# Altium project PCB_Slave_Traffic_Light.PrjPcb (part 3 of 4)
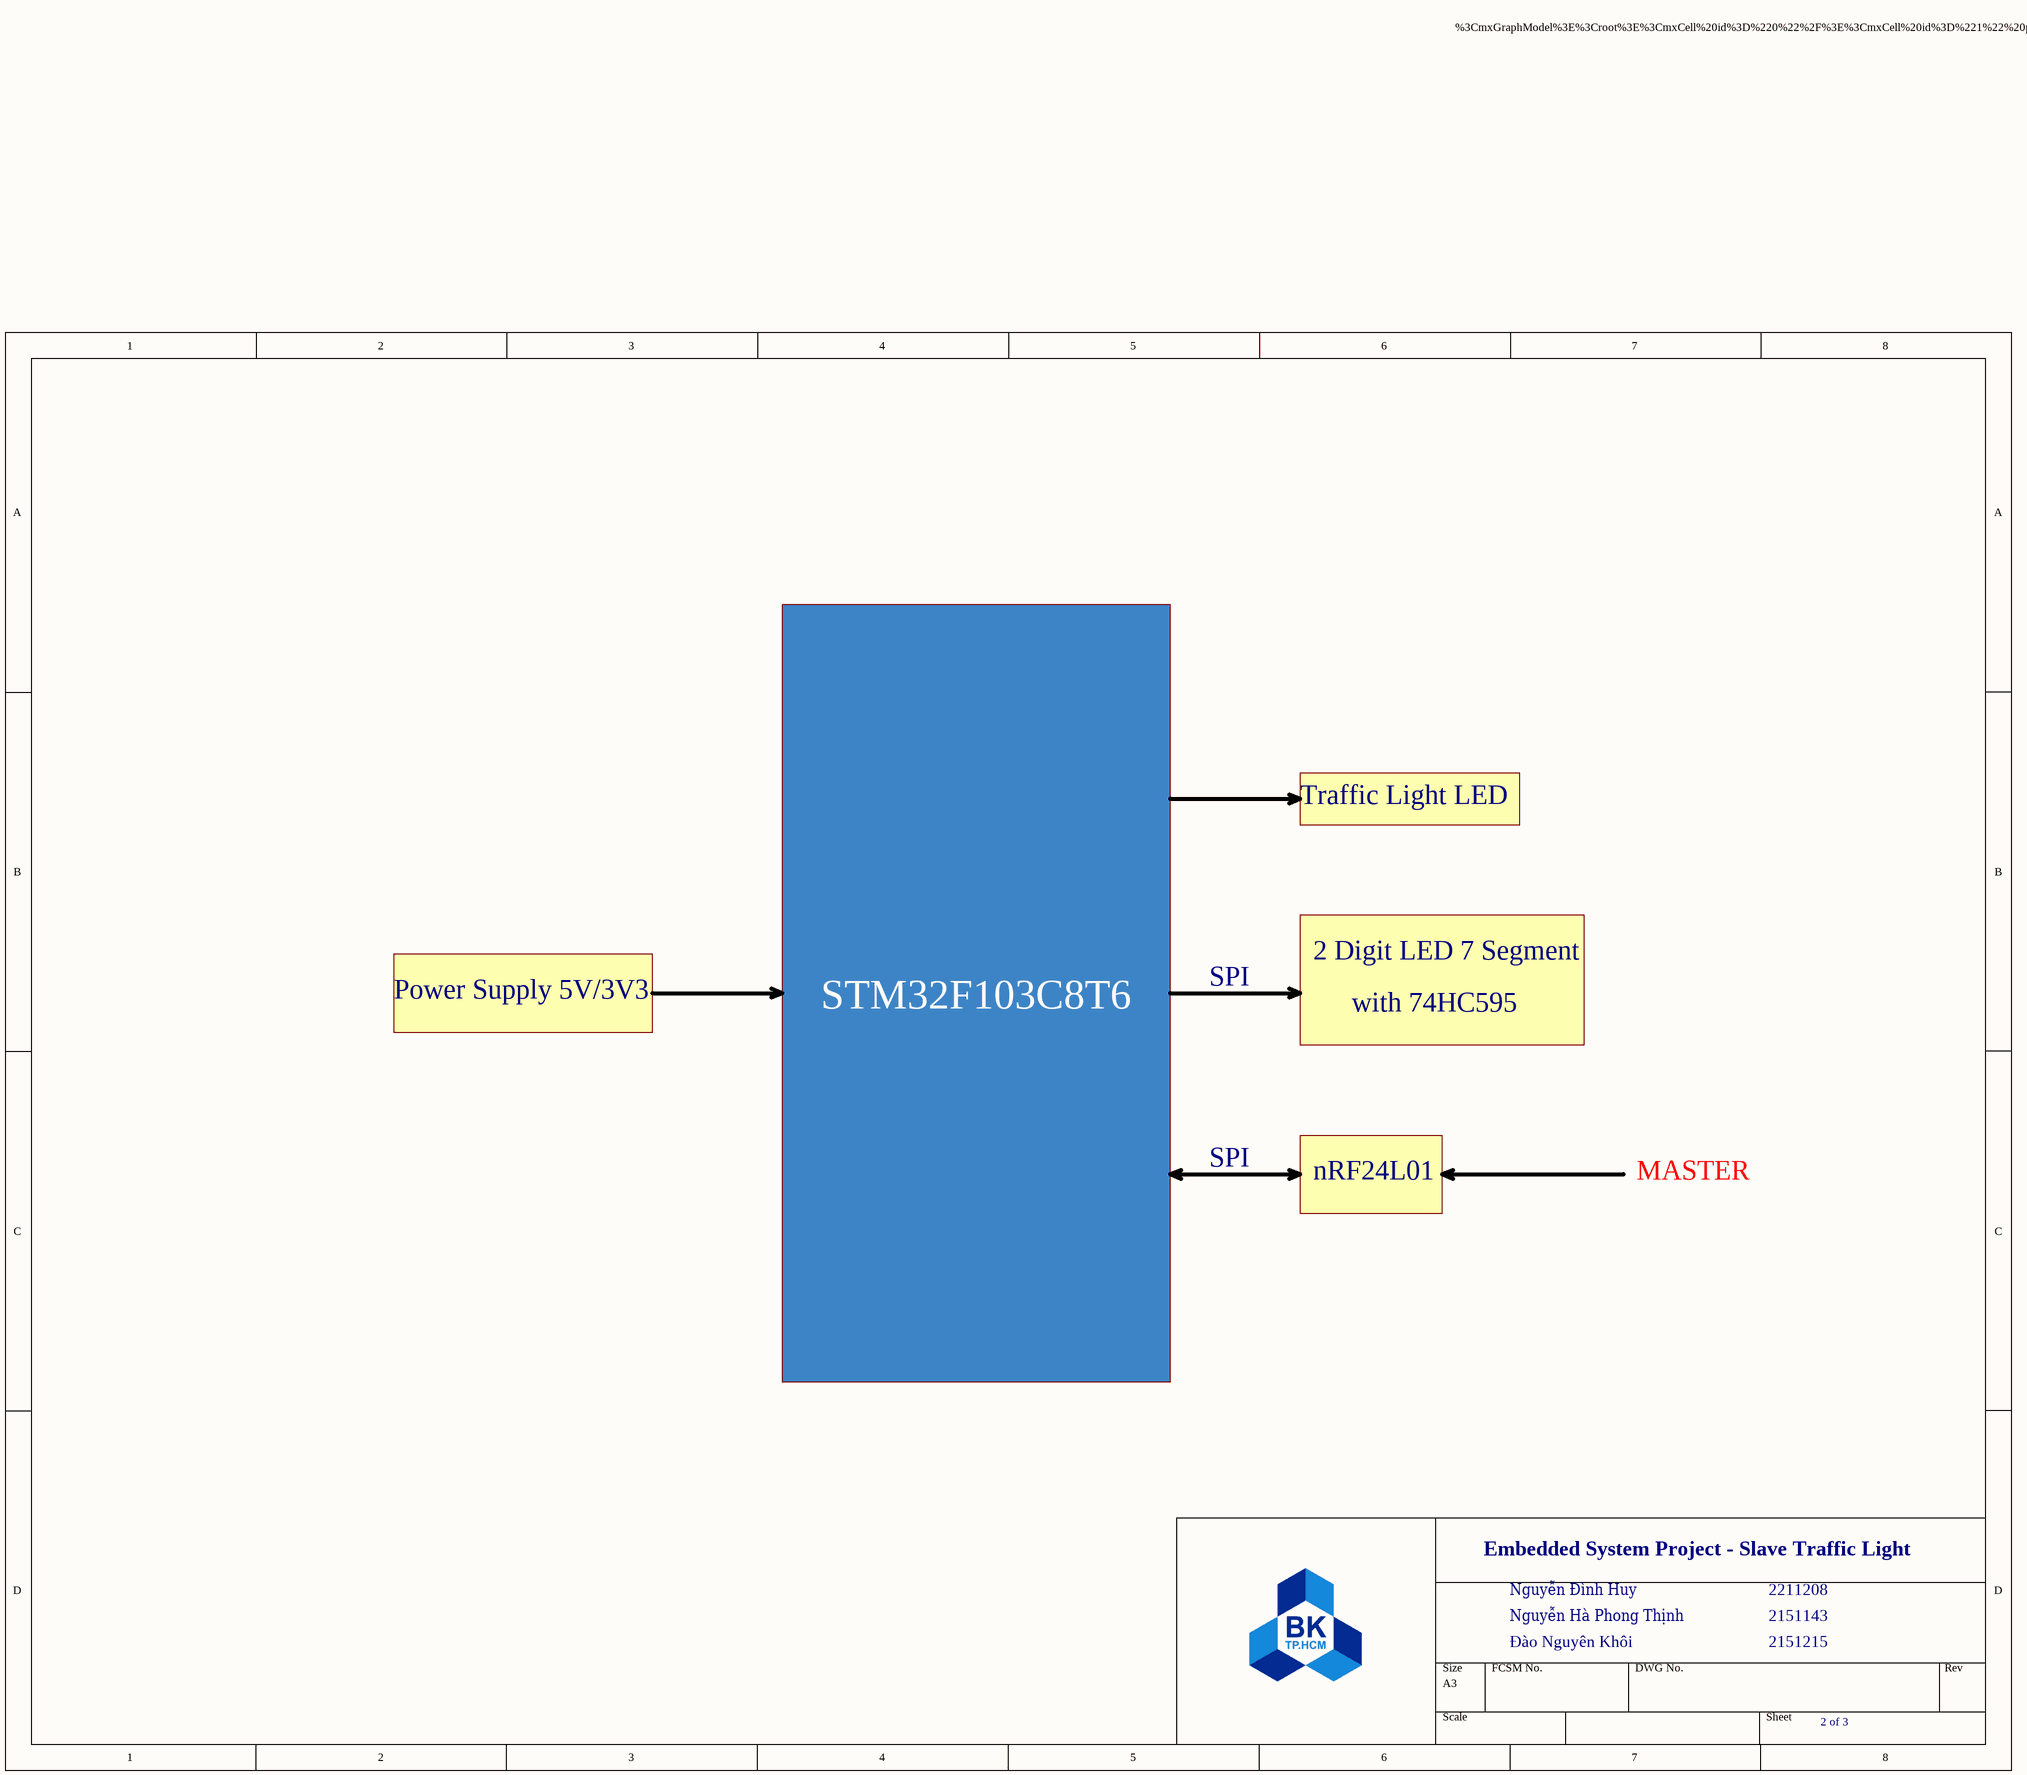
[diagram p4: PCB_Slave_Traffic_Light_BLOCK_DIAGRAM.SchDoc]

## Sheet PCB_Slave_Traffic_Light_BLOCK_DIAGRAM.SchDoc (continued)
0%22%20value%3D%22R1%26lt%3Bdiv%26gt%3B10k%26lt%3B%2Fdiv%26gt%3B%22%20style%3D%22text%3Bhtml%3D1%3Balign%3Dcenter%3BverticalAlign%3Dmiddle%3BwhiteSpace%3Dwrap%3Brounded%3D0%3B%22%20vertex%3D%221%22%20parent%3D%221%22%3E%3CmxGeometry%20x%3D%22528.4%22%20y%3D%221658.46%22%20width%3D%2226%22%20height%3D%2230%22%20as%3D%22geometry%22%2F%3E%3C%2FmxCell%3E%3CmxCell%20id%3D%22111%22%20style%3D%22edgeStyle%3DorthogonalEdgeStyle%3Brounded%3D0%3BorthogonalLoop%3D1%3BjettySize%3Dauto%3Bhtml%3D1%3BexitX%3D0%3BexitY%3D0.5%3BexitDx%3D0%3BexitDy%3D0%3BendArrow%3Dnone%3BstartFill%3D0%3BentryX%3D0.078%3BentryY%3D0.93%3BentryDx%3D0%3BentryDy%3D0%3BentryPerimeter%3D0%3B%22%20edge%3D%221%22%20source%3D%22112%22%20target%3D%22120%22%20parent%3D%221%22%3E%3CmxGeometry%20relative%3D%221%22%20as%3D%22geometry%22%3E%3CmxPoint%20x%3D%22174.4%22%20y%3D%221774.0281690140846%22%20as%3D%22targetPoint%22%2F%3E%3C%2FmxGeometry%3E%3C%2FmxCell%3E%3CmxCell%20id%3D%22112%22%20value%3D%22%26lt%3Bfont%26gt%3BSDA%26lt%3B%2Ffont%26gt%3B%22%20style%3D%22text%3Bhtml%3D1%3Balign%3Dcenter%3BverticalAlign%3Dmiddle%3BwhiteSpace%3Dwrap%3Brounded%3D0%3BfontSize%3D10%3B%22%20vertex%3D%221%22%20parent%3D%221%22%3E%3CmxGeometry%20x%3D%22234.4%22%20y%3D%221769%22%20width%3D%2230%22%20height%3D%2210%22%20as%3D%22geometry%22%2F%3E%3C%2FmxCell%3E%3CmxCell%20id%3D%22113%22%20value%3D%22%26lt%3Bfont%26gt%3BSCL%26lt%3B%2Ffont%26gt%3B%22%20style%3D%22text%3Bhtml%3D1%3Balign%3Dcenter%3BverticalAlign%3Dmiddle%3BwhiteSpace%3Dwrap%3Brounded%3D0%3BfontSize%3D10%3B%22%20vertex%3D%221%22%20parent%3D%221%22%3E%3CmxGeometry%20x%3D%22234.4%22%20y%3D%221784%22%20width%3D%2230%22%20height%3D%2210%22%20as%3D%22geometry%22%2F%3E%3C%2FmxCell%3E%3CmxCell%20id%3D%22114%22%20style%3D%22edgeStyle%3DorthogonalEdgeStyle%3Brounded%3D0%3BorthogonalLoop%3D1%3BjettySize%3Dauto%3Bhtml%3D1%3BexitX%3D0%3BexitY%3D0.5%3BexitDx%3D0%3BexitDy%3D0%3BendArrow%3Dnone%3BstartFill%3D0%3B%22%20edge%3D%221%22%20source%3D%22115%22%20parent%3D%221%22%3E%3CmxGeometry%20relative%3D%221%22%20as%3D%22geometry%22%3E%3CmxPoint%20x%3D%22194.4%22%20y%3D%222014%22%20as%3D%22targetPoint%22%2F%3E%3CArray%20as%3D%22points%22%3E%3CmxPoint%20x%3D%22194.4%22%20y%3D%221979%22%2F%3E%3C%2FArray%3E%3C%2FmxGeometry%3E%3C%2FmxCell%3E%3CmxCell%20id%3D%22115%22%20value%3D%22%26lt%3Bspan%20style%3D%26quot%3Bfont-size%3A%2010px%3B%26quot%3B%26gt%3BGND%26lt%3B%2Fspan%26gt%3B%22%20style%3D%22text%3Bhtml%3D1%3Balign%3Dcenter%3BverticalAlign%3Dmiddle%3BwhiteSpace%3Dwrap%3Brounded%3D0%3B%22%20vertex%3D%221%22%20parent%3D%221%22%3E%3CmxGeometry%20x%3D%22234.4%22%20y%3D%221974%22%20width%3D%2230%22%20height%3D%2210%22%20as%3D%22geometry%22%2F%3E%3C%2FmxCell%3E%3CmxCell%20id%3D%22116%22%20style%3D%22edgeStyle%3DorthogonalEdgeStyle%3Brounded%3D0%3BorthogonalLoop%3D1%3BjettySize%3Dauto%3Bhtml%3D1%3BexitX%3D0%3BexitY%3D0.5%3BexitDx%3D0%3BexitDy%3D0%3BendArrow%3Dnone%3BstartFill%3D0%3B%22%20edge%3D%221%22%20source%3D%22117%22%20parent%3D%221%22%3E%3CmxGeometry%20relative%3D%221%22%20as%3D%22geometry%22%3E%3CmxPoint%20x%3D%22194.4%22%20y%3D%221758.9876543209878%22%20as%3D%22targetPoint%22%2F%3E%3C%2FmxGeometry%3E%3C%2FmxCell%3E%3CmxCell%20id%3D%22117%22%20value%3D%22%26lt%3Bfont%26gt%3BVCC%26lt%3B%2Ffont%26gt%3B%22%20style%3D%22text%3Bhtml%3D1%3Balign%3Dcenter%3BverticalAlign%3Dmiddle%3BwhiteSpace%3Dwrap%3Brounded%3D0%3BfontSize%3D10%3B%22%20vertex%3D%221%22%20parent%3D%221%22%3E%3CmxGeometry%20x%3D%22234.4%22%20y%3D%221754%22%20width%3D%2230%22%20height%3D%2210%22%20as%3D%22geometry%22%2F%3E%3C%2FmxCell%3E%3CmxCell%20id%3D%22118%22%20value%3D%22Out5%22%20style%3D%22text%3Bhtml%3D1%3Balign%3Dcenter%3BverticalAlign%3Dmiddle%3BwhiteSpace%3Dwrap%3Brounded%3D0%3BfontSize%3D10%3B%22%20vertex%3D%221%22%20parent%3D%221%22%3E%3CmxGeometry%20x%3D%22192.2%22%20y%3D%221747%22%20width%3D%2225.6%22%20height%3D%228%22%20as%3D%22geometry%22%2F%3E%3C%2FmxCell%3E%3CmxCell%20id%3D%22119%22%20value%3D%22PB10%22%20style%3D%22text%3Bhtml%3D1%3Balign%3Dcenter%3BverticalAlign%3Dmiddle%3BwhiteSpace%3Dwrap%3Brounded%3D0%3BfontSize%3D10%3B%22%20vertex%3D%221%22%20parent%3D%221%22%3E%3CmxGeometry%20x%3D%22192.2%22%20y%3D%221779%22%20width%3D%2230%22%20height%3D%2210%22%20as%3D%22geometry%22%2F%3E%3C%2FmxCell%3E%3CmxCell%20id%3D%22120%22%20value%3D%22PB11%22%20style%3D%22text%3Bhtml%3D1%3Balign%3Dcenter%3BverticalAlign%3Dmiddle%3BwhiteSpace%3Dwrap%3Brounded%3D0%3BfontSize%3D10%3B%22%20vertex%3D%221%22%20parent%3D%221%22%3E%3CmxGeometry%20x%3D%22192.2%22%20y%3D%221764%22%20width%3D%2230%22%20height%3D%2210%22%20as%3D%22geometry%22%2F%3E%3C%2FmxCell%3E%3CmxCell%20id%3D%22121%22%20style%3D%22edgeStyle%3DorthogonalEdgeStyle%3Brounded%3D0%3BorthogonalLoop%3D1%3BjettySize%3Dauto%3Bhtml%3D1%3BexitX%3D0%3BexitY%3D0.5%3BexitDx%3D0%3BexitDy%3D0%3BentryX%3D0.077%3BentryY%3D0.928%3BentryDx%3D0%3BentryDy%3D0%3BentryPerimeter%3D0%3BendArrow%3Dnone%3BstartFill%3D0%3B%22%20edge%3D%221%22%20source%3D%22113%22%20target%3D%22119%22%20parent%3D%221%22%3E%3CmxGeometry%20relative%3D%221%22%20as%3D%22geometry%22%2F%3E%3C%2FmxCell%3E%3CmxCell%20id%3D%22122%22%20style%3D%22edgeStyle%3DorthogonalEdgeStyle%3Brounded%3D0%3BorthogonalLoop%3D1%3BjettySize%3Dauto%3Bhtml%3D1%3BexitX%3D1%3BexitY%3D0.5%3BexitDx%3D0%3BexitDy%3D0%3BendArrow%3Dnone%3BstartFill%3D0%3B%22%20edge%3D%221%22%20source%3D%22123%22%20parent%3D%221%22%3E%3CmxGeometry%20relative%3D%221%22%20as%3D%22geometry%22%3E%3CmxPoint%20x%3D%22794.4%22%20y%3D%221749%22%20as%3D%22targetPoint%22%2F%3E%3C%2FmxGeometry%3E%3C%2FmxCell%3E%3CmxCell%20id%3D%22123%22%20value%3D%22%26lt%3Bfont%20style%3D%26quot%3Bfont-size%3A%2010px%3B%26quot%3B%26gt%3BPA8%26lt%3B%2Ffont%26gt%3B%22%20style%3D%22text%3Bhtml%3D1%3Balign%3Dcenter%3BverticalAlign%3Dmiddle%3BwhiteSpace%3Dwrap%3Brounded%3D0%3B%22%20vertex%3D%221%22%20parent%3D%221%22%3E%3CmxGeometry%20x%3D%22724.4%22%20y%3D%221744%22%20width%3D%2230%22%20height%3D%2210%22%20as%3D%22geometry%22%2F%3E%3C%2FmxCell%3E%3CmxCell%20id%3D%22124%22%20style%3D%22edgeStyle%3DorthogonalEdgeStyle%3Brounded%3D0%3BorthogonalLoop%3D1%3BjettySize%3Dauto%3Bhtml%3D1%3BexitX%3D1%3BexitY%3D0.5%3BexitDx%3D0%3BexitDy%3D0%3BendArrow%3Dnone%3BstartFill%3D0%3B%22%20edge%3D%221%22%20source%3D%22125%22%20parent%3D%221%22%3E%3CmxGeometry%20relative%3D%221%22%20as%3D%22geometry%22%3E%3CmxPoint%20x%3D%22794.4%22%20y%3D%221739%22%20as%3D%22targetPoint%22%2F%3E%3C%2FmxGeometry%3E%3C%2FmxCell%3E%3CmxCell%20id%3D%22125%22%20value%3D%22%26lt%3Bfont%20style%3D%26quot%3Bfont-size%3A%2010px%3B%26quot%3B%26gt%3BPA9%26lt%3B%2Ffont%26gt%3B%22%20style%3D%22text%3Bhtml%3D1%3Balign%3Dcenter%3BverticalAlign%3Dmiddle%3BwhiteSpace%3Dwrap%3Brounded%3D0%3B%22%20vertex%3D%221%22%20parent%3D%221%22%3E%3CmxGeometry%20x%3D%22724.4%22%20y%3D%221734%22%20width%3D%2230%22%20height%3D%2210%22%20as%3D%22geometry%22%2F%3E%3C%2FmxCell%3E%3CmxCell%20id%3D%22126%22%20style%3D%22edgeStyle%3DorthogonalEdgeStyle%3Brounded%3D0%3BorthogonalLoop%3D1%3BjettySize%3Dauto%3Bhtml%3D1%3BexitX%3D1%3BexitY%3D0.5%3BexitDx%3D0%3BexitDy%3D0%3BendArrow%3Dnone%3BstartFill%3D0%3B%22%20edge%3D%221%22%20source%3D%22127%22%20parent%3D%221%22%3E%3CmxGeometry%20relative%3D%221%22%20as%3D%22geometry%22%3E%3CmxPoint%20x%3D%22794.4%22%20y%3D%221728%22%20as%3D%22targetPoint%22%2F%3E%3C%2FmxGeometry%3E%3C%2FmxCell%3E%3CmxCell%20id%3D%22127%22%20value%3D%22%26lt%3Bfont%20style%3D%26quot%3Bfont-size%3A%2010px%3B%26quot%3B%26gt%3BPA10%26lt%3B%2Ffont%26gt%3B%22%20style%3D%22text%3Bhtml%3D1%3Balign%3Dcenter%3BverticalAlign%3Dmiddle%3BwhiteSpace%3Dwrap%3Brounded%3D0%3B%22%20vertex%3D%221%22%20parent%3D%221%22%3E%3CmxGeometry%20x%3D%22724.4%22%20y%3D%221722.92%22%20width%3D%2230%22%20height%3D%2210%22%20as%3D%22geometry%22%2F%3E%3C%2FmxCell%3E%3CmxCell%20id%3D%22128%22%20value%3D%22%26lt%3Bfont%20style%3D%26quot%3Bfont-size%3A%2010px%3B%26quot%3B%26gt%3BPA10%26lt%3B%2Ffont%26gt%3B%22%20style%3D%22text%3Bhtml%3D1%3Balign%3Dcenter%3BverticalAlign%3Dmiddle%3BwhiteSpace%3Dwrap%3Brounded%3D0%3B%22%20vertex%3D%221%22%20parent%3D%221%22%3E%3CmxGeometry%20x%3D%22774.4%22%20y%3D%221722.92%22%20width%3D%2220%22%20height%3D%220.54%22%20as%3D%22geometry%22%2F%3E%3C%2FmxCell%3E%3CmxCell%20id%3D%22129%22%20value%3D%22%26lt%3Bfont%20style%3D%26quot%3Bfont-size%3A%2010px%3B%26quot%3B%26gt%3BPA9%26lt%3B%2Ffont%26gt%3B%22%20style%3D%22text%3Bhtml%3D1%3Balign%3Dcenter%3BverticalAlign%3Dmiddle%3BwhiteSpace%3Dwrap%3Brounded%3D0%3B%22%20vertex%3D%221%22%20parent%3D%221%22%3E%3CmxGeometry%20x%3D%22774.4%22%20y%3D%221732.92%22%20width%3D%2220%22%20height%3D%221.08%22%20as%3D%22geometry%22%2F%3E%3C%2FmxCell%3E%3CmxCell%20id%3D%22130%22%20value%3D%22%26lt%3Bfont%20style%3D%26quot%3Bfont-size%3A%2010px%3B%26quot%3B%26gt%3BPA8%26lt%3B%2Ffont%26gt%3B%22%20style%3D%22text%3Bhtml%3D1%3Balign%3Dcenter%3BverticalAlign%3Dmiddle%3BwhiteSpace%3Dwrap%3Brounded%3D0%3B%22%20vertex%3D%221%22%20parent%3D%221%22%3E%3CmxGeometry%20x%3D%22774.4%22%20y%3D%221742.92%22%20width%3D%2220%22%20height%3D%221.08%22%20as%3D%22geometry%22%2F%3E%3C%2FmxCell%3E%3CmxCell%20id%3D%22131%22%20style%3D%22edgeStyle%3DorthogonalEdgeStyle%3Brounded%3D0%3BorthogonalLoop%3D1%3BjettySize%3Dauto%3Bhtml%3D1%3BexitX%3D0%3BexitY%3D0.5%3BexitDx%3D0%3BexitDy%3D0%3BendArrow%3Dnone%3BstartFill%3D0%3B%22%20edge%3D%221%22%20source%3D%22132%22%20parent%3D%221%22%3E%3CmxGeometry%20relative%3D%221%22%20as%3D%22geometry%22%3E%3CmxPoint%20x%3D%22594.4%22%20y%3D%221749.0467289719627%22%20as%3D%22targetPoint%22%2F%3E%3C%2FmxGeometry%3E%3C%2FmxCell%3E%3CmxCell%20id%3D%22132%22%20value%3D%22%26lt%3Bfont%20style%3D%26quot%3Bfont-size%3A%2010px%3B%26quot%3B%26gt%3BPB11%26lt%3B%2Ffont%26gt%3B%22%20style%3D%22text%3Bhtml%3D1%3Balign%3Dcenter%3BverticalAlign%3Dmiddle%3BwhiteSpace%3Dwrap%3Brounded%3D0%3B%22%20vertex%3D%221%22%20parent%3D%221%22%3E%3CmxGeometry%20x%3D%22634.4%22%20y%3D%221744%22%20width%3D%2230%22%20height%3D%2210%22%20as%3D%22geometry%22%2F%3E%3C%2FmxCell%3E%3CmxCell%20id%3D%22133%22%20style%3D%22edgeStyle%3DorthogonalEdgeStyle%3Brounded%3D0%3BorthogonalLoop%3D1%3BjettySize%3Dauto%3Bhtml%3D1%3BexitX%3D0%3BexitY%3D0.5%3BexitDx%3D0%3BexitDy%3D0%3BendArrow%3Dnone%3BstartFill%3D0%3B%22%20edge%3D%221%22%20source%3D%22134%22%20parent%3D%221%22%3E%3CmxGeometry%20relative%3D%221%22%20as%3D%22geometry%22%3E%3CmxPoint%20x%3D%22594.4%22%20y%3D%221739.0467289719627%22%20as%3D%22targetPoint%22%2F%3E%3C%2FmxGeometry%3E%3C%2FmxCell%3E%3CmxCell%20id%3D%22134%22%20value%3D%22%26lt%3Bfont%20style%3D%26quot%3Bfont-size%3A%2010px%3B%26quot%3B%26gt%3BPB10%26lt%3B%2Ffont%26gt%3B%22%20style%3D%22text%3Bhtml%3D1%3Balign%3Dcenter%3BverticalAlign%3Dmiddle%3BwhiteSpace%3Dwrap%3Brounded%3D0%3B%22%20vertex%3D%221%22%20parent%3D%221%22%3E%3CmxGeometry%20x%3D%22634.4%22%20y%3D%221734%22%20width%3D%2230%22%20height%3D%2210%22%20as%3D%22geometry%22%2F%3E%3C%2FmxCell%3E%3CmxCell%20id%3D%22135%22%20value%3D%22%26lt%3Bfont%26gt%3BPB11%26lt%3B%2Ffont%26gt%3B%22%20style%3D%22text%3Bhtml%3D1%3Balign%3Dcenter%3BverticalAlign%3Dmiddle%3BwhiteSpace%3Dwrap%3Brounded%3D0%3BfontSize%3D10%3B%22%20vertex%3D%221%22%20parent%3D%221%22%3E%3CmxGeometry%20x%3D%22598.4%22%20y%3D%221739.54%22%20width%3D%2220%22%20height%3D%2210%22%20as%3D%22geometry%22%2F%3E%3C%2FmxCell%3E%3CmxCell%20id%3D%22136%22%20value%3D%22%26lt%3Bfont%26gt%3BPB10%26lt%3B%2Ffont%26gt%3B%22%20style%3D%22text%3Bhtml%3D1%3Balign%3Dcenter%3BverticalAlign%3Dmiddle%3BwhiteSpace%3Dwrap%3Brounded%3D0%3BfontSize%3D10%3B%22%20vertex%3D%221%22%20parent%3D%221%22%3E%3CmxGeometry%20x%3D%22598.4%22%20y%3D%221729.54%22%20width%3D%2220%22%20height%3D%2210%22%20as%3D%22geometry%22%2F%3E%3C%2FmxCell%3E%3CmxCell%20id%3D%22137%22%20style%3D%22edgeStyle%3DorthogonalEdgeStyle%3Brounded%3D0%3BorthogonalLoop%3D1%3BjettySize%3Dauto%3Bhtml%3D1%3BexitX%3D1%3BexitY%3D0.5%3BexitDx%3D0%3BexitDy%3D0%3BendArrow%3Dnone%3BstartFill%3D0%3B%22%20edge%3D%221%22%20source%3D%22138%22%20parent%3D%221%22%3E%3CmxGeometry%20relative%3D%221%22%20as%3D%22geometry%22%3E%3CmxPoint%20x%3D%22430%22%20y%3D%221287.4545454545455%22%20as%3D%22targetPoint%22%2F%3E%3C%2FmxGeometry%3E%3C%2FmxCell%3E%3CmxCell%20id%3D%22138%22%20value%3D%22VDD%22%20style%3D%22text%3Bhtml%3D1%3Balign%3Dcenter%3BverticalAlign%3Dmiddle%3BwhiteSpace%3Dwrap%3Brounded%3D0%3BfontSize%3D10%3B%22%20vertex%3D%221%22%20parent%3D%221%22%3E%3CmxGeometry%20x%3D%22364%22%20y%3D%221280%22%20width%3D%2226%22%20height%3D%2215%22%20as%3D%22geometry%22%2F%3E%3C%2FmxCell%3E%3CmxCell%20id%3D%22139%22%20style%3D%22edgeStyle%3DorthogonalEdgeStyle%3Brounded%3D0%3BorthogonalLoop%3D1%3BjettySize%3Dauto%3Bhtml%3D1%3BexitX%3D1%3BexitY%3D0.5%3BexitDx%3D0%3BexitDy%3D0%3BendArrow%3Dnone%3BstartFill%3D0%3B%22%20edge%3D%221%22%20source%3D%22140%22%20parent%3D%221%22%3E%3CmxGeometry%20relative%3D%221%22%20as%3D%22geometry%22%3E%3CmxPoint%20x%3D%22430%22%20y%3D%221317.4545454545455%22%20as%3D%22targetPoint%22%2F%3E%3C%2FmxGeometry%3E%3C%2FmxCell%3E%3CmxCell%20id%3D%22140%22%20value%3D%22CE%22%20style%3D%22text%3Bhtml%3D1%3Balign%3Dcenter%3BverticalAlign%3Dmiddle%3BwhiteSpace%3Dwrap%3Brounded%3D0%3BfontSize%3D10%3B%22%20vertex%3D%221%22%20parent%3D%221%22%3E%3CmxGeometry%20x%3D%22364%22%20y%3D%221310%22%20width%3D%2226%22%20height%3D%2215%22%20as%3D%22geometry%22%2F%3E%3C%2FmxCell%3E%3CmxCell%20id%3D%22141%22%20style%3D%22edgeStyle%3DorthogonalEdgeStyle%3Brounded%3D0%3BorthogonalLoop%3D1%3BjettySize%3Dauto%3Bhtml%3D1%3BexitX%3D1%3BexitY%3D0.5%3BexitDx%3D0%3BexitDy%3D0%3BendArrow%3Dnone%3BstartFill%3D0%3B%22%20edge%3D%221%22%20source%3D%22142%22%20parent%3D%221%22%3E%3CmxGeometry%20relative%3D%221%22%20as%3D%22geometry%22%3E%3CmxPoint%20x%3D%22430%22%20y%3D%221331.4805194805194%22%20as%3D%22targetPoint%22%2F%3E%3C%2FmxGeometry%3E%3C%2FmxCell%3E%3CmxCell%20id%3D%22142%22%20value%3D%22SCK%22%20style%3D%22text%3Bhtml%3D1%3Balign%3Dcenter%3BverticalAlign%3Dmiddle%3BwhiteSpace%3Dwrap%3Brounded%3D0%3BfontSize%3D10%3B%22%20vertex%3D%221%22%20parent%3D%221%22%3E%3CmxGeometry%20x%3D%22364%22%20y%3D%221323.92%22%20width%3D%2226%22%20height%3D%2215%22%20as%3D%22geometry%22%2F%3E%3C%2FmxCell%3E%3CmxCell%20id%3D%22143%22%20style%3D%22edgeStyle%3DorthogonalEdgeStyle%3Brounded%3D0%3BorthogonalLoop%3D1%3BjettySize%3Dauto%3Bhtml%3D1%3BexitX%3D1%3BexitY%3D0.5%3BexitDx%3D0%3BexitDy%3D0%3BendArrow%3Dnone%3BstartFill%3D0%3B%22%20edge%3D%221%22%20source%3D%22144%22%20parent%3D%221%22%3E%3CmxGeometry%20relative%3D%221%22%20as%3D%22geometry%22%3E%3CmxPoint%20x%3D%22430%22%20y%3D%221345%22%20as%3D%22targetPoint%22%2F%3E%3CArray%20as%3D%22points%22%3E%3CmxPoint%20x%3D%22430%22%20y%3D%221345%22%2F%3E%3C%2FArray%3E%3C%2FmxGeometry%3E%3C%2FmxCell%3E%3CmxCell%20id%3D%22144%22%20value%3D%22MISO%22%20style%3D%22text%3Bhtml%3D1%3Balign%3Dcenter%3BverticalAlign%3Dmiddle%3BwhiteSpace%3Dwrap%3Brounded%3D0%3BfontSize%3D10%3B%22%20vertex%3D%221%22%20parent%3D%221%22%3E%3CmxGeometry%20x%3D%22364%22%20y%3D%221337.5%22%20width%3D%2226%22%20height%3D%2215%22%20as%3D%22geometry%22%2F%3E%3C%2FmxCell%3E%3CmxCell%20id%3D%22145%22%20style%3D%22edgeStyle%3DorthogonalEdgeStyle%3Brounded%3D0%3BorthogonalLoop%3D1%3BjettySize%3Dauto%3Bhtml%3D1%3BexitX%3D1%3BexitY%3D0.5%3BexitDx%3D0%3BexitDy%3D0%3BendArrow%3Dnone%3BstartFill%3D0%3B%22%20edge%3D%221%22%20source%3D%22146%22%20parent%3D%221%22%3E%3CmxGeometry%20relative%3D%221%22%20as%3D%22geometry%22%3E%3CmxPoint%20x%3D%22430%22%20y%3D%221360%22%20as%3D%22targetPoint%22%2F%3E%3CArray%20as%3D%22points%22%3E%3CmxPoint%20x%3D%22420%22%20y%3D%221360%22%2F%3E%3CmxPoint%20x%3D%22420%22%20y%3D%221360%22%2F%3E%3C%2FArray%3E%3C%2FmxGeometry%3E%3C%2FmxCell%3E%3CmxCell%20id%3D%22146%22%20value%3D%22MOSI%22%20style%3D%22text%3Bhtml%3D1%3Balign%3Dcenter%3BverticalAlign%3Dmiddle%3BwhiteSpace%3Dwrap%3Brounded%3D0%3BfontSize%3D10%3B%22%20vertex%3D%221%22%20parent%3D%221%22%3E%3CmxGeometry%20x%3D%22364%22%20y%3D%221352.5%22%20width%3D%2226%22%20height%3D%2215%22%20as%3D%22geometry%22%2F%3E%3C%2FmxCell%3E%3CmxCell%20id%3D%22147%22%20style%3D%22edgeStyle%3DorthogonalEdgeStyle%3Brounded%3D0%3BorthogonalLoop%3D1%3BjettySize%3Dauto%3Bhtml%3D1%3BexitX%3D1%3BexitY%3D0.5%3BexitDx%3D0%3BexitDy%3D0%3BendArrow%3Dnone%3BstartFill%3D0%3B%22%20edge%3D%221%22%20source%3D%22148%22%20parent%3D%221%22%3E%3CmxGeometry%20relative%3D%221%22%20as%3D%22geometry%22%3E%3CmxPoint%20x%3D%22429%22%20y%3D%221420%22%20as%3D%22targetPoint%22%2F%3E%3CmxPoint%20x%3D%22389%22%20y%3D%221388.92%22%20as%3D%22sourcePoint%22%2F%3E%3CArray%20as%3D%22points%22%3E%3CmxPoint%20x%3D%22430%22%20y%3D%221389%22%2F%3E%3CmxPoint%20x%3D%22430%22%20y%3D%221420%22%2F%3E%3C%2FArray%3E%3C%2FmxGeometry%3E%3C%2FmxCell%3E%3CmxCell%20id%3D%22148%22%20value%3D%22GND%22%20style%3D%22text%3Bhtml%3D1%3Balign%3Dcenter%3BverticalAlign%3Dmiddle%3BwhiteSpace%3Dwrap%3Brounded%3D0%3BfontSize%3D10%3B%22%20vertex%3D%221%22%20parent%3D%221%22%3E%3CmxGeometry%20x%3D%22364%22%20y%3D%221383.92%22%20width%3D%2226%22%20height%3D%2210%22%20as%3D%22geometry%22%2F%3E%3C%2FmxCell%3E%3CmxCell%20id%3D%22149%22%20style%3D%22edgeStyle%3DorthogonalEdgeStyle%3Brounded%3D0%3BorthogonalLoop%3D1%3BjettySize%3Dauto%3Bhtml%3D1%3BexitX%3D0%3BexitY%3D0.5%3BexitDx%3D0%3BexitDy%3D0%3BendArrow%3Dnone%3BstartFill%3D0%3B%22%20edge%3D%221%22%20source%3D%22150%22%20parent%3D%221%22%3E%3CmxGeometry%20relative%3D%221%22%20as%3D%22geometry%22%3E%3CmxPoint%20x%3D%22190%22%20y%3D%221327.4545454545455%22%20as%3D%22targetPoint%22%2F%3E%3C%2FmxGeometry%3E%3C%2FmxCell%3E%3CmxCell%20id%3D%22150%22%20value%3D%22IRQ%22%20style%3D%22text%3Bhtml%3D1%3Balign%3Dcenter%3BverticalAlign%3Dmiddle%3BwhiteSpace%3Dwrap%3Brounded%3D0%3BfontSize%3D10%3B%22%20vertex%3D%221%22%20parent%3D%221%22%3E%3CmxGeometry%20x%3D%22229.6%22%20y%3D%221320%22%20width%3D%2226%22%20height%3D%2215%22%20as%3D%22geometry%22%2F%3E%3C%2FmxCell%3E%3CmxCell%20id%3D%22151%22%20style%3D%22edgeStyle%3DorthogonalEdgeStyle%3Brounded%3D0%3BorthogonalLoop%3D1%3BjettySize%3Dauto%3Bhtml%3D1%3BexitX%3D0%3BexitY%3D0.5%3BexitDx%3D0%3BexitDy%3D0%3BendArrow%3Dnone%3BstartFill%3D0%3B%22%20edge%3D%221%22%20source%3D%22152%22%20parent%3D%221%22%3E%3CmxGeometry%20relative%3D%221%22%20as%3D%22geometry%22%3E%3CmxPoint%20x%3D%22190%22%20y%3D%221357.4545454545455%22%20as%3D%22targetPoint%22%2F%3E%3C%2FmxGeometry%3E%3C%2FmxCell%3E%3CmxCell%20id%3D%22152%22%20value%3D%22CSN%22%20style%3D%22text%3Bhtml%3D1%3Balign%3Dcenter%3BverticalAlign%3Dmiddle%3BwhiteSpace%3Dwrap%3Brounded%3D0%3BfontSize%3D10%3B%22%20vertex%3D%221%22%20parent%3D%221%22%3E%3CmxGeometry%20x%3D%22230%22%20y%3D%221350%22%20width%3D%2226%22%20height%3D%2215%22%20as%3D%22geometry%22%2F%3E%3C%2FmxCell%3E%3CmxCell%20id%3D%22153%22%20value%3D%22%22%20style%3D%22endArrow%3Dnone%3Bhtml%3D1%3Brounded%3D0%3BexitX%3D0.875%3BexitY%3D0.002%3BexitDx%3D0%3BexitDy%3D0%3BexitPerimeter%3D0%3BentryX%3D0.175%3BentryY%3D0.016%3BentryDx%3D0%3BentryDy%3D0%3BentryPerimeter%3D0%3B%22%20edge%3D%221%22%20source%3D%22150%22%20target%3D%22150%22%20parent%3D%221%22%3E%3CmxGeometry%20width%3D%2250%22%20height%3D%2250%22%20relative%3D%221%22%20as%3D%22geometry%22%3E%3CmxPoint%20x%3D%22245.4%22%20y%3D%221321.51%22%20as%3D%22sourcePoint%22%2F%3E%3CmxPoint%20x%3D%22239.79999999999998%22%20y%3D%221320.0046236559142%22%20as%3D%22targetPoint%22%2F%3E%3C%2FmxGeometry%3E%3C%2FmxCell%3E%3CmxCell%20id%3D%22154%22%20value%3D%22%22%20style%3D%22endArrow%3Dnone%3Bhtml%3D1%3Brounded%3D0%3BexitX%3D0.875%3BexitY%3D0.002%3BexitDx%3D0%3BexitDy%3D0%3BexitPerimeter%3D0%3BentryX%3D0.175%3BentryY%3D0.016%3BentryDx%3D0%3BentryDy%3D0%3BentryPerimeter%3D0%3B%22%20edge%3D%221%22%20parent%3D%221%22%3E%3CmxGeometry%20width%3D%2250%22%20height%3D%2250%22%20relative%3D%221%22%20as%3D%22geometry%22%3E%3CmxPoint%20x%3D%22251.6%22%20y%3D%221350%22%20as%3D%22sourcePoint%22%2F%3E%3CmxPoint%20x%3D%22233.6%22%20y%3D%221350%22%20as%3D%22targetPoint%22%2F%3E%3C%2FmxGeometry%3E%3C%2FmxCell%3E%3CmxCell%20id%3D%22155%22%20value%3D%22PA1%22%20style%3D%22text%3Bhtml%3D1%3Balign%3Dcenter%3BverticalAlign%3Dmiddle%3BwhiteSpace%3Dwrap%3Brounded%3D0%3BfontSize%3D10%3B%22%20vertex%3D%221%22%20parent%3D%221%22%3E%3CmxGeometry%20x%3D%22410%22%20y%3D%221280%22%20width%3D%2220%22%20as%3D%22geometry%22%2F%3E%3C%2FmxCell%3E%3CmxCell%20id%3D%22156%22%20value%3D%22PA3%22%20style%3D%22text%3Bhtml%3D1%3Balign%3Dcenter%3BverticalAlign%3Dmiddle%3BwhiteSpace%3Dwrap%3Brounded%3D0%3BfontSize%3D10%3B%22%20vertex%3D%221%22%20parent%3D%221%22%3E%3CmxGeometry%20x%3D%22410%22%20y%3D%221310%22%20width%3D%2220%22%20as%3D%22geometry%22%2F%3E%3C%2FmxCell%3E%3CmxCell%20id%3D%22157%22%20value%3D%22PA5%22%20style%3D%22text%3Bhtml%3D1%3Balign%3Dcenter%3BverticalAlign%3Dmiddle%3BwhiteSpace%3Dwrap%3Brounded%3D0%3BfontSize%3D10%3B%22%20vertex%3D%221%22%20parent%3D%221%22%3E%3CmxGeometry%20x%3D%22410%22%20y%3D%221325%22%20width%3D%2220%22%20as%3D%22geometry%22%2F%3E%3C%2FmxCell%3E%3CmxCell%20id%3D%22158%22%20value%3D%22PA6%22%20style%3D%22text%3Bhtml%3D1%3Balign%3Dcenter%3BverticalAlign%3Dmiddle%3BwhiteSpace%3Dwrap%3Brounded%3D0%3BfontSize%3D10%3B%22%20vertex%3D%221%22%20parent%3D%221%22%3E%3CmxGeometry%20x%3D%22410%22%20y%3D%221338.92%22%20width%3D%2220%22%20as%3D%22geometry%22%2F%3E%3C%2FmxCell%3E%3CmxCell%20id%3D%22159%22%20value%3D%22PA7%22%20style%3D%22text%3Bhtml%3D1%3Balign%3Dcenter%3BverticalAlign%3Dmiddle%3BwhiteSpace%3Dwrap%3Brounded%3D0%3BfontSize%3D10%3B%22%20vertex%3D%221%22%20parent%3D%221%22%3E%3CmxGeometry%20x%3D%22410%22%20y%3D%221353.92%22%20width%3D%2220%22%20as%3D%22geometry%22%2F%3E%3C%2FmxCell%3E%3CmxCell%20id%3D%22160%22%20value%3D%22PA0%22%20style%3D%22text%3Bhtml%3D1%3Balign%3Dcenter%3BverticalAlign%3Dmiddle%3BwhiteSpace%3Dwrap%3Brounded%3D0%3BfontSize%3D10%3B%22%20vertex%3D%221%22%20parent%3D%221%22%3E%3CmxGeometry%20x%3D%22190%22%20y%3D%221320%22%20width%3D%2220%22%20as%3D%22geometry%22%2F%3E%3C%2FmxCell%3E%3CmxCell%20id%3D%22161%22%20value%3D%22PA4%22%20style%3D%22text%3Bhtml%3D1%3Balign%3Dcenter%3BverticalAlign%3Dmiddle%3BwhiteSpace%3Dwrap%3Brounded%3D0%3BfontSize%3D10%3B%22%20vertex%3D%221%22%20parent%3D%221%22%3E%3CmxGeometry%20x%3D%22190%22%20y%3D%221350%22%20width%3D%2220%22%20as%3D%22geometry%22%2F%3E%3C%2FmxCell%3E%3CmxCell%20id%3D%22162%22%20value%3D%22%26lt%3Bfont%20style%3D%26quot%3Bfont-size%3A%2010px%3B%26quot%3B%26gt%3BPA7%26lt%3B%2Ffont%26gt%3B%22%20style%3D%22text%3Bhtml%3D1%3Balign%3Dcenter%3BverticalAlign%3Dmiddle%3BwhiteSpace%3Dwrap%3Brounded%3D0%3B%22%20vertex%3D%221%22%20parent%3D%221%22%3E%3CmxGeometry%20x%3D%22634.4%22%20y%3D%221704%22%20width%3D%2230%22%20height%3D%2210%22%20as%3D%22geometry%22%2F%3E%3C%2FmxCell%3E%3CmxCell%20id%3D%22163%22%20value%3D%22%26lt%3Bfont%20style%3D%26quot%3Bfont-size%3A%2010px%3B%26quot%3B%26gt%3BPA6%26lt%3B%2Ffont%26gt%3B%22%20style%3D%22text%3Bhtml%3D1%3Balign%3Dcenter%3BverticalAlign%3Dmiddle%3BwhiteSpace%3Dwrap%3Brounded%3D0%3B%22%20vertex%3D%221%22%20parent%3D%221%22%3E%3CmxGeometry%20x%3D%22634.4%22%20y%3D%221694%22%20width%3D%2230%22%20height%3D%2210%22%20as%3D%22geometry%22%2F%3E%3C%2FmxCell%3E%3CmxCell%20id%3D%22164%22%20value%3D%22%26lt%3Bfont%20style%3D%26quot%3Bfont-size%3A%2010px%3B%26quot%3B%26gt%3BPA5%26lt%3B%2Ffont%26gt%3B%22%20style%3D%22text%3Bhtml%3D1%3Balign%3Dcenter%3BverticalAlign%3Dmiddle%3BwhiteSpace%3Dwrap%3Brounded%3D0%3B%22%20vertex%3D%221%22%20parent%3D%221%22%3E%3CmxGeometry%20x%3D%22634.4%22%20y%3D%221684%22%20width%3D%2230%22%20height%3D%2210%22%20as%3D%22geometry%22%2F%3E%3C%2FmxCell%3E%3CmxCell%20id%3D%22165%22%20value%3D%22%26lt%3Bspan%20style%3D%26quot%3Bfont-size%3A%2010px%3B%26quot%3B%26gt%3BPA4%26lt%3B%2Fspan%26gt%3B%22%20style%3D%22text%3Bhtml%3D1%3Balign%3Dcenter%3BverticalAlign%3Dmiddle%3BwhiteSpace%3Dwrap%3Brounded%3D0%3B%22%20vertex%3D%221%22%20parent%3D%221%22%3E%3CmxGeometry%20x%3D%22634.4%22%20y%3D%221674%22%20width%3D%2230%22%20height%3D%2210%22%20as%3D%22geometry%22%2F%3E%3C%2FmxCell%3E%3CmxCell%20id%3D%22166%22%20value%3D%22%26lt%3Bfont%20style%3D%26quot%3Bfont-size%3A%2010px%3B%26quot%3B%26gt%3BPA3%26lt%3B%2Ffont%26gt%3B%22%20style%3D%22text%3Bhtml%3D1%3Balign%3Dcenter%3BverticalAlign%3Dmiddle%3BwhiteSpace%3Dwrap%3Brounded%3D0%3B%22%20vertex%3D%221%22%20parent%3D%221%22%3E%3CmxGeometry%20x%3D%22634.4%22%20y%3D%221664%22%20width%3D%2230%22%20height%3D%2210%22%20as%3D%22geometry%22%2F%3E%3C%2FmxCell%3E%3CmxCell%20id%3D%22167%22%20value%3D%22%26lt%3Bfont%20style%3D%26quot%3Bfont-size%3A%2010px%3B%26quot%3B%26gt%3BPA1%26lt%3B%2Ffont%26gt%3B%22%20style%3D%22text%3Bhtml%3D1%3Balign%3Dcenter%3BverticalAlign%3Dmiddle%3BwhiteSpace%3Dwrap%3Brounded%3D0%3B%22%20vertex%3D%221%22%20parent%3D%221%22%3E%3CmxGeometry%20x%3D%22634.4%22%20y%3D%221644%22%20width%3D%2230%22%20height%3D%2210%22%20as%3D%22geometry%22%2F%3E%3C%2FmxCell%3E%3CmxCell%20id%3D%22168%22%20value%3D%22%26lt%3Bfont%20style%3D%26quot%3Bfont-size%3A%2010px%3B%26quot%3B%26gt%3BPA0%26lt%3B%2Ffont%26gt%3B%22%20style%3D%22text%3Bhtml%3D1%3Balign%3Dcenter%3BverticalAlign%3Dmiddle%3BwhiteSpace%3Dwrap%3Brounded%3D0%3B%22%20vertex%3D%221%22%20parent%3D%221%22%3E%3CmxGeometry%20x%3D%22634.4%22%20y%3D%221634.13%22%20width%3D%2230%22%20height%3D%2210%22%20as%3D%22geometry%22%2F%3E%3C%2FmxCell%3E%3CmxCell%20id%3D%22169%22%20value%3D%22%26lt%3Bfont%20style%3D%26quot%3Bfont-size%3A%2010px%3B%26quot%3B%26gt%3BOut3.3%26lt%3B%2Ffont%26gt%3B%22%20style%3D%22text%3Bhtml%3D1%3Balign%3Dcenter%3BverticalAlign%3Dmiddle%3BwhiteSpace%3Dwrap%3Brounded%3D0%3B%22%20vertex%3D%221%22%20parent%3D%221%22%3E%3CmxGeometry%20x%3D%22774.4%22%20y%3D%221593.19%22%20width%3D%2220%22%20height%3D%220.54%22%20as%3D%22geometry%22%2F%3E%3C%2FmxCell%3E%3CmxCell%20id%3D%22170%22%20value%3D%22%26lt%3Bspan%20style%3D%26quot%3Bfont-size%3A%2010px%3B%26quot%3B%26gt%3BOut5%26lt%3B%2Fspan%26gt%3B%22%20style%3D%22text%3Bhtml%3D1%3Balign%3Dcenter%3BverticalAlign%3Dmiddle%3BwhiteSpace%3Dwrap%3Brounded%3D0%3B%22%20vertex%3D%221%22%20parent%3D%221%22%3E%3CmxGeometry%20x%3D%22774.4%22%20y%3D%221611.38%22%20width%3D%2220%22%20height%3D%220.54%22%20as%3D%22geometry%22%2F%3E%3C%2FmxCell%3E%3CmxCell%20id%3D%22171%22%20style%3D%22edgeStyle%3DorthogonalEdgeStyle%3Brounded%3D0%3BorthogonalLoop%3D1%3BjettySize%3Dauto%3Bhtml%3D1%3BexitX%3D1%3BexitY%3D0.5%3BexitDx%3D0%3BexitDy%3D0%3BendArrow%3Dnone%3BstartFill%3D0%3B%22%20edge%3D%221%22%20source%3D%22172%22%20parent%3D%221%22%3E%3CmxGeometry%20relative%3D%221%22%20as%3D%22geometry%22%3E%3CmxPoint%20x%3D%22794.4%22%20y%3D%221670.142857142857%22%20as%3D%22targetPoint%22%2F%3E%3C%2FmxGeometry%3E%3C%2FmxCell%3E%3CmxCell%20id%3D%22172%22%20value%3D%22%26lt%3Bfont%20style%3D%26quot%3Bfont-size%3A%2010px%3B%26quot%3B%26gt%3BPB5%26lt%3B%2Ffont%26gt%3B%22%20style%3D%22text%3Bhtml%3D1%3Balign%3Dcenter%3BverticalAlign%3Dmiddle%3BwhiteSpace%3Dwrap%3Brounded%3D0%3B%22%20vertex%3D%221%22%20parent%3D%221%22%3E%3CmxGeometry%20x%3D%22724.4%22%20y%3D%221665.13%22%20width%3D%2230%22%20height%3D%2210%22%20as%3D%22geometry%22%2F%3E%3C%2FmxCell%3E%3CmxCell%20id%3D%22173%22%20style%3D%22edgeStyle%3DorthogonalEdgeStyle%3Brounded%3D0%3BorthogonalLoop%3D1%3BjettySize%3Dauto%3Bhtml%3D1%3BexitX%3D1%3BexitY%3D0.5%3BexitDx%3D0%3BexitDy%3D0%3BendArrow%3Dnone%3BstartFill%3D0%3B%22%20edge%3D%221%22%20source%3D%22174%22%20parent%3D%221%22%3E%3CmxGeometry%20relative%3D%221%22%20as%3D%22geometry%22%3E%3CmxPoint%20x%3D%22794.4%22%20y%3D%221660.121951219512%22%20as%3D%22targetPoint%22%2F%3E%3C%2FmxGeometry%3E%3C%2FmxCell%3E%3CmxCell%20id%3D%22174%22%20value%3D%22%26lt%3Bfont%20style%3D%26quot%3Bfont-size%3A%2010px%3B%26quot%3B%26gt%3BPB6%26lt%3B%2Ffont%26gt%3B%22%20style%3D%22text%3Bhtml%3D1%3Balign%3Dcenter%3BverticalAlign%3Dmiddle%3BwhiteSpace%3Dwrap%3Brounded%3D0%3B%22%20vertex%3D%221%22%20parent%3D%221%22%3E%3CmxGeometry%20x%3D%22724.4%22%20y%3D%221655.13%22%20width%3D%2230%22%20height%3D%2210%22%20as%3D%22geometry%22%2F%3E%3C%2FmxCell%3E%3CmxCell%20id%3D%22175%22%20style%3D%22edgeStyle%3DorthogonalEdgeStyle%3Brounded%3D0%3BorthogonalLoop%3D1%3BjettySize%3Dauto%3Bhtml%3D1%3BexitX%3D1%3BexitY%3D0.5%3BexitDx%3D0%3BexitDy%3D0%3BendArrow%3Dnone%3BstartFill%3D0%3B%22%20edge%3D%221%22%20source%3D%22176%22%20parent%3D%221%22%3E%3CmxGeometry%20relative%3D%221%22%20as%3D%22geometry%22%3E%3CmxPoint%20x%3D%22794.4%22%20y%3D%221650.1707317073171%22%20as%3D%22targetPoint%22%2F%3E%3C%2FmxGeometry%3E%3C%2FmxCell%3E%3CmxCell%20id%3D%22176%22%20value%3D%22%26lt%3Bfont%20style%3D%26quot%3Bfont-size%3A%2010px%3B%26quot%3B%26gt%3BPB7%26lt%3B%2Ffont%26gt%3B%22%20style%3D%22text%3Bhtml%3D1%3Balign%3Dcenter%3BverticalAlign%3Dmiddle%3BwhiteSpace%3Dwrap%3Brounded%3D0%3B%22%20vertex%3D%221%22%20parent%3D%221%22%3E%3CmxGeometry%20x%3D%22724.4%22%20y%3D%221645.13%22%20width%3D%2230%22%20height%3D%2210%22%20as%3D%22geometry%22%2F%3E%3C%2FmxCell%3E%3CmxCell%20id%3D%22177%22%20style%3D%22edgeStyle%3DorthogonalEdgeStyle%3Brounded%3D0%3BorthogonalLoop%3D1%3BjettySize%3Dauto%3Bhtml%3D1%3BexitX%3D1%3BexitY%3D0.5%3BexitDx%3D0%3BexitDy%3D0%3BendArrow%3Dnone%3BstartFill%3D0%3B%22%20edge%3D%221%22%20source%3D%22178%22%20parent%3D%221%22%3E%3CmxGeometry%20relative%3D%221%22%20as%3D%22geometry%22%3E%3CmxPoint%20x%3D%22794.4%22%20y%3D%221640.121951219512%22%20as%3D%22targetPoint%22%2F%3E%3C%2FmxGeometry%3E%3C%2FmxCell%3E%3CmxCell%20id%3D%22178%22%20value%3D%22%26lt%3Bfont%20style%3D%26quot%3Bfont-size%3A%2010px%3B%26quot%3B%26gt%3BPB8%26lt%3B%2Ffont%26gt%3B%22%20style%3D%22text%3Bhtml%3D1%3Balign%3Dcenter%3BverticalAlign%3Dmiddle%3BwhiteSpace%3Dwrap%3Brounded%3D0%3B%22%20vertex%3D%221%22%20parent%3D%221%22%3E%3CmxGeometry%20x%3D%22724.4%22%20y%3D%221635.13%22%20width%3D%2230%22%20height%3D%2210%22%20as%3D%22geometry%22%2F%3E%3C%2FmxCell%3E%3CmxCell%20id%3D%22179%22%20style%3D%22edgeStyle%3DorthogonalEdgeStyle%3Brounded%3D0%3BorthogonalLoop%3D1%3BjettySize%3Dauto%3Bhtml%3D1%3BexitX%3D1%3BexitY%3D0.5%3BexitDx%3D0%3BexitDy%3D0%3BendArrow%3Dnone%3BstartFill%3D0%3B%22%20edge%3D%221%22%20source%3D%22180%22%20parent%3D%221%22%3E%3CmxGeometry%20relative%3D%221%22%20as%3D%22geometry%22%3E%3CmxPoint%20x%3D%22794.4%22%20y%3D%221630.1707317073171%22%20as%3D%22targetPoint%22%2F%3E%3C%2FmxGeometry%3E%3C%2FmxCell%3E%3CmxCell%20id%3D%22180%22%20value%3D%22%26lt%3Bfont%20style%3D%26quot%3Bfont-size%3A%2010px%3B%26quot%3B%26gt%3BPB9%26lt%3B%2Ffont%26gt%3B%22%20style%3D%22text%3Bhtml%3D1%3Balign%3Dcenter%3BverticalAlign%3Dmiddle%3BwhiteSpace%3Dwrap%3Brounded%3D0%3B%22%20vertex%3D%221%22%20parent%3D%221%22%3E%3CmxGeometry%20x%3D%22724.4%22%20y%3D%221625.13%22%20width%3D%2230%22%20height%3D%2210%22%20as%3D%22geometry%22%2F%3E%3C%2FmxCell%3E%3CmxCell%20id%3D%22181%22%20value%3D%22%26lt%3Bspan%20style%3D%26quot%3Bfont-size%3A%2010px%3B%26quot%3B%26gt%3BPB9%26lt%3B%2Fspan%26gt%3B%22%20style%3D%22text%3Bhtml%3D1%3Balign%3Dcenter%3BverticalAlign%3Dmiddle%3BwhiteSpace%3Dwrap%3Brounded%3D0%3B%22%20vertex%3D%221%22%20parent%3D%221%22%3E%3CmxGeometry%20x%3D%22774.4%22%20y%3D%221625.13%22%20width%3D%2220%22%20height%3D%220.54%22%20as%3D%22geometry%22%2F%3E%3C%2FmxCell%3E%3CmxCell%20id%3D%22182%22%20value%3D%22%26lt%3Bspan%20style%3D%26quot%3Bfont-size%3A%2010px%3B%26quot%3B%26gt%3BPB8%26lt%3B%2Fspan%26gt%3B%22%20style%3D%22text%3Bhtml%3D1%3Balign%3Dcenter%3BverticalAlign%3Dmiddle%3BwhiteSpace%3Dwrap%3Brounded%3D0%3B%22%20vertex%3D%221%22%20parent%3D%221%22%3E%3CmxGeometry%20x%3D%22774.4%22%20y%3D%221635.13%22%20width%3D%2220%22%20height%3D%220.54%22%20as%3D%22geometry%22%2F%3E%3C%2FmxCell%3E%3CmxCell%20id%3D%22183%22%20value%3D%22%26lt%3Bspan%20style%3D%26quot%3Bfont-size%3A%2010px%3B%26quot%3B%26gt%3BPB7%26lt%3B%2Fspan%26gt%3B%22%20style%3D%22text%3Bhtml%3D1%3Balign%3Dcenter%3BverticalAlign%3Dmiddle%3BwhiteSpace%3Dwrap%3Brounded%3D0%3B%22%20vertex%3D%221%22%20parent%3D%221%22%3E%3CmxGeometry%20x%3D%22774.4%22%20y%3D%221645.13%22%20width%3D%2220%22%20height%3D%220.54%22%20as%3D%22geometry%22%2F%3E%3C%2FmxCell%3E%3CmxCell%20id%3D%22184%22%20value%3D%22%26lt%3Bspan%20style%3D%26quot%3Bfont-size%3A%2010px%3B%26quot%3B%26gt%3BPB6%26lt%3B%2Fspan%26gt%3B%22%20style%3D%22text%3Bhtml%3D1%3Balign%3Dcenter%3BverticalAlign%3Dmiddle%3BwhiteSpace%3Dwrap%3Brounded%3D0%3B%22%20vertex%3D%221%22%20parent%3D%221%22%3E%3CmxGeometry%20x%3D%22774.4%22%20y%3D%221655.13%22%20width%3D%2220%22%20as%3D%22geometry%22%2F%3E%3C%2FmxCell%3E%3CmxCell%20id%3D%22185%22%20value%3D%22%26lt%3Bspan%20style%3D%26quot%3Bfont-size%3A%2010px%3B%26quot%3B%26gt%3BPB5%26lt%3B%2Fspan%26gt%3B%22%20style%3D%22text%3Bhtml%3D1%3Balign%3Dcenter%3BverticalAlign%3Dmiddle%3BwhiteSpace%3Dwrap%3Brounded%3D0%3B%22%20vertex%3D%221%22%20parent%3D%221%22%3E%3CmxGeometry%20x%3D%22774.4%22%20y%3D%221665.13%22%20width%3D%2220%22%20as%3D%22geometry%22%2F%3E%3C%2FmxCell%3E%3CmxCell%20id%3D%22186%22%20value%3D%22%26lt%3Bspan%20style%3D%26quot%3Bfont-size%3A%2010px%3B%26quot%3B%26gt%3BPB5%26lt%3B%2Fspan%26gt%3B%22%20style%3D%22text%3Bhtml%3D1%3Balign%3Dcenter%3BverticalAlign%3Dmiddle%3BwhiteSpace%3Dwrap%3Brounded%3D0%3B%22%20vertex%3D%221%22%20parent%3D%221%22%3E%3CmxGeometry%20x%3D%22841.68%22%20y%3D%221830%22%20width%3D%2220%22%20as%3D%22geometry%22%2F%3E%3C%2FmxCell%3E%3CmxCell%20id%3D%22187%22%20value%3D%22%26lt%3Bspan%20style%3D%26quot%3Bfont-size%3A%2010px%3B%26quot%3B%26gt%3BPB6%26lt%3B%2Fspan%26gt%3B%22%20style%3D%22text%3Bhtml%3D1%3Balign%3Dcenter%3BverticalAlign%3Dmiddle%3BwhiteSpace%3Dwrap%3Brounded%3D0%3B%22%20vertex%3D%221%22%20parent%3D%221%22%3E%3CmxGeometry%20x%3D%22960%22%20y%3D%221829%22%20width%3D%2220%22%20as%3D%22geometry%22%2F%3E%3C%2FmxCell%3E%3CmxCell%20id%3D%22188%22%20value%3D%22%26lt%3Bspan%20style%3D%26quot%3Bfont-size%3A%2010px%3B%26quot%3B%26gt%3BPB7%26lt%3B%2Fspan%26gt%3B%22%20style%3D%22text%3Bhtml%3D1%3Balign%3Dcenter%3BverticalAlign%3Dmiddle%3BwhiteSpace%3Dwrap%3Brounded%3D0%3B%22%20vertex%3D%221%22%20parent%3D%221%22%3E%3CmxGeometry%20x%3D%22760%22%20y%3D%221873.73%22%20width%3D%2220%22%20height%3D%220.54%22%20as%3D%22geometry%22%2F%3E%3C%2FmxCell%3E%3CmxCell%20id%3D%22189%22%20value%3D%22%26lt%3Bspan%20style%3D%26quot%3Bfont-size%3A%2010px%3B%26quot%3B%26gt%3BPB8%26lt%3B%2Fspan%26gt%3B%22%20style%3D%22text%3Bhtml%3D1%3Balign%3Dcenter%3BverticalAlign%3Dmiddle%3BwhiteSpace%3Dwrap%3Brounded%3D0%3B%22%20vertex%3D%221%22%20parent%3D%221%22%3E%3CmxGeometry%20x%3D%22880%22%20y%3D%221873.19%22%20width%3D%2220%22%20height%3D%220.54%22%20as%3D%22geometry%22%2F%3E%3C%2FmxCell%3E%3CmxCell%20id%3D%22190%22%20value%3D%22%26lt%3Bspan%20style%3D%26quot%3Bfont-size%3A%2010px%3B%26quot%3B%26gt%3BPB9%26lt%3B%2Fspan%26gt%3B%22%20style%3D%22text%3Bhtml%3D1%3Balign%3Dcenter%3BverticalAlign%3Dmiddle%3BwhiteSpace%3Dwrap%3Brounded%3D0%3B%22%20vertex%3D%221%22%20parent%3D%221%22%3E%3CmxGeometry%20x%3D%221000%22%20y%3D%221872.65%22%20width%3D%2220%22%20height%3D%220.54%22%20as%3D%22geometry%22%2F%3E%3C%2FmxCell%3E%3CmxCell%20id%3D%22191%22%20value%3D%22%22%20style%3D%22endArrow%3Dnone%3Bhtml%3D1%3Brounded%3D0%3Bmovable%3D1%3Bresizable%3D1%3Brotatable%3D1%3Bdeletable%3D1%3Beditable%3D1%3Blocked%3D0%3Bconnectable%3D1%3B%22%20edge%3D%221%22%20parent%3D%221%22%3E%3CmxGeometry%20width%3D%2250%22%20height%3D%2250%22%20relative%3D%221%22%20as%3D%22geometry%22%3E%3CmxPoint%20x%3D%22919.998461538461%22%20y%3D%221800%22%20as%3D%22sourcePoint%22%2F%3E%3CmxPoint%20x%3D%22919.998461538461%22%20y%3D%221820%22%20as%3D%22targetPoint%22%2F%3E%3C%2FmxGeometry%3E%3C%2FmxCell%3E%3CmxCell%20id%3D%22192%22%20value%3D%22%22%20style%3D%22endArrow%3Dnone%3Bhtml%3D1%3Brounded%3D0%3Bmovable%3D1%3Bresizable%3D1%3Brotatable%3D1%3Bdeletable%3D1%3Beditable%3D1%3Blocked%3D0%3Bconnectable%3D1%3B%22%20edge%3D%221%22%20parent%3D%221%22%3E%3CmxGeometry%20width%3D%2250%22%20height%3D%2250%22%20relative%3D%221%22%20as%3D%22geometry%22%3E%3CmxPoint%20x%3D%22890%22%20y%3D%221799.9956410256416%22%20as%3D%22sourcePoint%22%2F%3E%3CmxPoint%20x%3D%22950%22%20y%3D%221799.9956410256416%22%20as%3D%22targetPoint%22%2F%3E%3C%2FmxGeometry%3E%3C%2FmxCell%3E%3CmxCell%20id%3D%22193%22%20value%3D%22%22%20style%3D%22endArrow%3Dnone%3Bhtml%3D1%3Brounded%3D0%3Bmovable%3D1%3Bresizable%3D1%3Brotatable%3D1%3Bdeletable%3D1%3Beditable%3D1%3Blocked%3D0%3Bconnectable%3D1%3B%22%20edge%3D%221%22%20parent%3D%221%22%3E%3CmxGeometry%20width%3D%2250%22%20height%3D%2250%22%20relative%3D%221%22%20as%3D%22geometry%22%3E%3CmxPoint%20x%3D%22900%22%20y%3D%221789.9956410256416%22%20as%3D%22sourcePoint%22%2F%3E%3CmxPoint%20x%3D%22940%22%20y%3D%221789.9956410256416%22%20as%3D%22targetPoint%22%2F%3E%3C%2FmxGeometry%3E%3C%2FmxCell%3E%3CmxCell%20id%3D%22194%22%20value%3D%22%22%20style%3D%22endArrow%3Dnone%3Bhtml%3D1%3Brounded%3D0%3Bmovable%3D1%3Bresizable%3D1%3Brotatable%3D1%3Bdeletable%3D1%3Beditable%3D1%3Blocked%3D0%3Bconnectable%3D1%3B%22%20edge%3D%221%22%20parent%3D%221%22%3E%3CmxGeometry%20width%3D%2250%22%20height%3D%2250%22%20relative%3D%221%22%20as%3D%22geometry%22%3E%3CmxPoint%20x%3D%22910%22%20y%3D%221778.9956410256416%22%20as%3D%22sourcePoint%22%2F%3E%3CmxPoint%20x%3D%22930%22%20y%3D%221778.9956410256416%22%20as%3D%22targetPoint%22%2F%3E%3C%2FmxGeometry%3E%3C%2FmxCell%3E%3CmxCell%20id%3D%22195%22%20value%3D%22%22%20style%3D%22endArrow%3Dnone%3Bhtml%3D1%3Brounded%3D0%3Bmovable%3D1%3Bresizable%3D1%3Brotatable%3D1%3Bdeletable%3D1%3Beditable%3D1%3Blocked%3D0%3Bconnectable%3D1%3B%22%20edge%3D%221%22%20parent%3D%221%22%3E%3CmxGeometry%20width%3D%2250%22%20height%3D%2250%22%20relative%3D%221%22%20as%3D%22geometry%22%3E%3CmxPoint%20x%3D%22959.998461538461%22%20y%3D%221900%22%20as%3D%22sourcePoint%22%2F%3E%3CmxPoint%20x%3D%22959.998461538461%22%20y%3D%221920%22%20as%3D%22targetPoint%22%2F%3E%3C%2FmxGeometry%3E%3C%2FmxCell%3E%3CmxCell%20id%3D%22196%22%20value%3D%22%22%20style%3D%22endArrow%3Dnone%3Bhtml%3D1%3Brounded%3D0%3Bmovable%3D1%3Bresizable%3D1%3Brotatable%3D1%3Bdeletable%3D1%3Beditable%3D1%3Blocked%3D0%3Bconnectable%3D1%3B%22%20edge%3D%221%22%20parent%3D%221%22%3E%3CmxGeometry%20width%3D%2250%22%20height%3D%2250%22%20relative%3D%221%22%20as%3D%22geometry%22%3E%3CmxPoint%20x%3D%22930%22%20y%3D%221920.9956410256416%22%20as%3D%22sourcePoint%22%2F%3E%3CmxPoint%20x%3D%22990%22%20y%3D%221920.9956410256416%22%20as%3D%22targetPoint%22%2F%3E%3C%2FmxGeometry%3E%3C%2FmxCell%3E%3CmxCell%20id%3D%22197%22%20value%3D%22%22%20style%3D%22endArrow%3Dnone%3Bhtml%3D1%3Brounded%3D0%3Bmovable%3D1%3Bresizable%3D1%3Brotatable%3D1%3Bdeletable%3D1%3Beditable%3D1%3Blocked%3D0%3Bconnectable%3D1%3B%22%20edge%3D%221%22%20parent%3D%221%22%3E%3CmxGeometry%20width%3D%2250%22%20height%3D%2250%22%20relative%3D%221%22%20as%3D%22geometry%22%3E%3CmxPoint%20x%3D%22940%22%20y%3D%221929.9956410256416%22%20as%3D%22sourcePoint%22%2F%3E%3CmxPoint%20x%3D%22980%22%20y%3D%221929.9956410256416%22%20as%3D%22targetPoint%22%2F%3E%3C%2FmxGeometry%3E%3C%2FmxCell%3E%3CmxCell%20id%3D%22198%22%20value%3D%22%22%20style%3D%22endArrow%3Dnone%3Bhtml%3D1%3Brounded%3D0%3Bmovable%3D1%3Bresizable%3D1%3Brotatable%3D1%3Bdeletable%3D1%3Beditable%3D1%3Blocked%3D0%3Bconnectable%3D1%3B%22%20edge%3D%221%22%20parent%3D%221%22%3E%3CmxGeometry%20width%3D%2250%22%20height%3D%2250%22%20relative%3D%221%22%20as%3D%22geometry%22%3E%3CmxPoint%20x%3D%22950%22%20y%3D%221939.9956410256416%22%20as%3D%22sourcePoint%22%2F%3E%3CmxPoint%20x%3D%22970%22%20y%3D%221939.9956410256416%22%20as%3D%22targetPoint%22%2F%3E%3C%2FmxGeometry%3E%3C%2FmxCell%3E%3CmxCell%20id%3D%22199%22%20value%3D%22%22%20style%3D%22endArrow%3Dnone%3Bhtml%3D1%3Brounded%3D0%3Bmovable%3D1%3Bresizable%3D1%3Brotatable%3D1%3Bdeletable%3D1%3Beditable%3D1%3Blocked%3D0%3Bconnectable%3D1%3B%22%20edge%3D%221%22%20parent%3D%221%22%3E%3CmxGeometry%20width%3D%2250%22%20height%3D%2250%22%20relative%3D%221%22%20as%3D%22geometry%22%3E%3CmxPoint%20x%3D%221079.998461538461%22%20y%3D%221900%22%20as%3D%22sourcePoint%22%2F%3E%3CmxPoint%20x%3D%221079.998461538461%22%20y%3D%221920%22%20as%3D%22targetPoint%22%2F%3E%3C%2FmxGeometry%3E%3C%2FmxCell%3E%3CmxCell%20id%3D%22200%22%20value%3D%22%22%20style%3D%22endArrow%3Dnone%3Bhtml%3D1%3Brounded%3D0%3Bmovable%3D1%3Bresizable%3D1%3Brotatable%3D1%3Bdeletable%3D1%3Beditable%3D1%3Blocked%3D0%3Bconnectable%3D1%3B%22%20edge%3D%221%22%20parent%3D%221%22%3E%3CmxGeometry%20width%3D%2250%22%20height%3D%2250%22%20relative%3D%221%22%20as%3D%22geometry%22%3E%3CmxPoint%20x%3D%221050%22%20y%3D%221920.9956410256416%22%20as%3D%22sourcePoint%22%2F%3E%3CmxPoint%20x%3D%221110%22%20y%3D%221920.9956410256416%22%20as%3D%22targetPoint%22%2F%3E%3C%2FmxGeometry%3E%3C%2FmxCell%3E%3CmxCell%20id%3D%22201%22%20value%3D%22%22%20style%3D%22endArrow%3Dnone%3Bhtml%3D1%3Brounded%3D0%3Bmovable%3D1%3Bresizable%3D1%3Brotatable%3D1%3Bdeletable%3D1%3Beditable%3D1%3Blocked%3D0%3Bconnectable%3D1%3B%22%20edge%3D%221%22%20parent%3D%221%22%3E%3CmxGeometry%20width%3D%2250%22%20height%3D%2250%22%20relative%3D%221%22%20as%3D%22geometry%22%3E%3CmxPoint%20x%3D%221060%22%20y%3D%221929.9956410256416%22%20as%3D%22sourcePoint%22%2F%3E%3CmxPoint%20x%3D%221100%22%20y%3D%221929.9956410256416%22%20as%3D%22targetPoint%22%2F%3E%3C%2FmxGeometry%3E%3C%2FmxCell%3E%3CmxCell%20id%3D%22202%22%20value%3D%22%22%20style%3D%22endArrow%3Dnone%3Bhtml%3D1%3Brounded%3D0%3Bmovable%3D1%3Bresizable%3D1%3Brotatable%3D1%3Bdeletable%3D1%3Beditable%3D1%3Blocked%3D0%3Bconnectable%3D1%3B%22%20edge%3D%221%22%20parent%3D%221%22%3E%3CmxGeometry%20width%3D%2250%22%20height%3D%2250%22%20relative%3D%221%22%20as%3D%22geometry%22%3E%3CmxPoint%20x%3D%221070%22%20y%3D%221939.9956410256416%22%20as%3D%22sourcePoint%22%2F%3E%3CmxPoint%20x%3D%221090%22%20y%3D%221939.9956410256416%22%20as%3D%22targetPoint%22%2F%3E%3C%2FmxGeometry%3E%3C%2FmxCell%3E%3CmxCell%20id%3D%22203%22%20value%3D%22%22%20style%3D%22endArrow%3Dnone%3Bhtml%3D1%3Brounded%3D0%3Bmovable%3D1%3Bresizable%3D1%3Brotatable%3D1%3Bdeletable%3D1%3Beditable%3D1%3Blocked%3D0%3Bconnectable%3D1%3B%22%20edge%3D%221%22%20parent%3D%221%22%3E%3CmxGeometry%20width%3D%2250%22%20height%3D%2250%22%20relative%3D%221%22%20as%3D%22geometry%22%3E%3CmxPoint%20x%3D%22839.998461538461%22%20y%3D%221900%22%20as%3D%22sourcePoint%22%2F%3E%3CmxPoint%20x%3D%22839.998461538461%22%20y%3D%221920%22%20as%3D%22targetPoint%22%2F%3E%3C%2FmxGeometry%3E%3C%2FmxCell%3E%3CmxCell%20id%3D%22204%22%20value%3D%22%22%20style%3D%22endArrow%3Dnone%3Bhtml%3D1%3Brounded%3D0%3Bmovable%3D1%3Bresizable%3D1%3Brotatable%3D1%3Bdeletable%3D1%3Beditable%3D1%3Blocked%3D0%3Bconnectable%3D1%3B%22%20edge%3D%221%22%20parent%3D%221%22%3E%3CmxGeometry%20width%3D%2250%22%20height%3D%2250%22%20relative%3D%221%22%20as%3D%22geometry%22%3E%3CmxPoint%20x%3D%22810%22%20y%3D%221920.9956410256416%22%20as%3D%22sourcePoint%22%2F%3E%3CmxPoint%20x%3D%22870%22%20y%3D%221920.9956410256416%22%20as%3D%22targetPoint%22%2F%3E%3C%2FmxGeometry%3E%3C%2FmxCell%3E%3CmxCell%20id%3D%22205%22%20value%3D%22%22%20style%3D%22endArrow%3Dnone%3Bhtml%3D1%3Brounded%3D0%3Bmovable%3D1%3Bresizable%3D1%3Brotatable%3D1%3Bdeletable%3D1%3Beditable%3D1%3Blocked%3D0%3Bconnectable%3D1%3B%22%20edge%3D%221%22%20parent%3D%221%22%3E%3CmxGeometry%20width%3D%2250%22%20height%3D%2250%22%20relative%3D%221%22%20as%3D%22geometry%22%3E%3CmxPoint%20x%3D%22820%22%20y%3D%221929.9956410256416%22%20as%3D%22sourcePoint%22%2F%3E%3CmxPoint%20x%3D%22860%22%20y%3D%221929.9956410256416%22%20as%3D%22targetPoint%22%2F%3E%3C%2FmxGeometry%3E%3C%2FmxCell%3E%3CmxCell%20id%3D%22206%22%20value%3D%22%22%20style%3D%22endArrow%3Dnone%3Bhtml%3D1%3Brounded%3D0%3Bmovable%3D1%3Bresizable%3D1%3Brotatable%3D1%3Bdeletable%3D1%3Beditable%3D1%3Blocked%3D0%3Bconnectable%3D1%3B%22%20edge%3D%221%22%20parent%3D%221%22%3E%3CmxGeometry%20width%3D%2250%22%20height%3D%2250%22%20relative%3D%221%22%20as%3D%22geometry%22%3E%3CmxPoint%20x%3D%22830%22%20y%3D%221939.9956410256416%22%20as%3D%22sourcePoint%22%2F%3E%3CmxPoint%20x%3D%22850%22%20y%3D%221939.9956410256416%22%20as%3D%22targetPoint%22%2F%3E%3C%2FmxGeometry%3E%3C%2FmxCell%3E%3CmxCell%20id%3D%22207%22%20style%3D%22edgeStyle%3DorthogonalEdgeStyle%3Brounded%3D0%3BorthogonalLoop%3D1%3BjettySize%3Dauto%3Bhtml%3D1%3BexitX%3D0%3BexitY%3D0.5%3BexitDx%3D0%3BexitDy%3D0%3BendArrow%3Dnone%3BstartFill%3D0%3B%22%20edge%3D%221%22%20parent%3D%221%22%3E%3CmxGeometry%20relative%3D%221%22%20as%3D%22geometry%22%3E%3CmxPoint%20x%3D%22595.1999999999999%22%20y%3D%221708.5067289719627%22%20as%3D%22targetPoint%22%2F%3E%3CmxPoint%20x%3D%22634.8%22%20y%3D%221708.46%22%20as%3D%22sourcePoint%22%2F%3E%3C%2FmxGeometry%3E%3C%2FmxCell%3E%3CmxCell%20id%3D%22208%22%20style%3D%22edgeStyle%3DorthogonalEdgeStyle%3Brounded%3D0%3BorthogonalLoop%3D1%3BjettySize%3Dauto%3Bhtml%3D1%3BexitX%3D0%3BexitY%3D0.5%3BexitDx%3D0%3BexitDy%3D0%3BendArrow%3Dnone%3BstartFill%3D0%3B%22%20edge%3D%221%22%20parent%3D%221%22%3E%3CmxGeometry%20relative%3D%221%22%20as%3D%22geometry%22%3E%3CmxPoint%20x%3D%22595.1999999999999%22%20y%3D%221698.5067289719627%22%20as%3D%22targetPoint%22%2F%3E%3CmxPoint%20x%3D%22634.8%22%20y%3D%221698.46%22%20as%3D%22sourcePoint%22%2F%3E%3C%2FmxGeometry%3E%3C%2FmxCell%3E%3CmxCell%20id%3D%22209%22%20value%3D%22%26lt%3Bfont%26gt%3BPA7%26lt%3B%2Ffont%26gt%3B%22%20style%3D%22text%3Bhtml%3D1%3Balign%3Dcenter%3BverticalAlign%3Dmiddle%3BwhiteSpace%3Dwrap%3Brounded%3D0%3BfontSize%3D10%3B%22%20vertex%3D%221%22%20parent%3D%221%22%3E%3CmxGeometry%20x%3D%22598.4%22%20y%3D%221704%22%20width%3D%2220%22%20height%3D%221%22%20as%3D%22geometry%22%2F%3E%3C%2FmxCell%3E%3CmxCell%20id%3D%22210%22%20value%3D%22%26lt%3Bfont%26gt%3BPA6%26lt%3B%2Ffont%26gt%3B%22%20style%3D%22text%3Bhtml%3D1%3Balign%3Dcenter%3BverticalAlign%3Dmiddle%3BwhiteSpace%3Dwrap%3Brounded%3D0%3BfontSize%3D10%3B%22%20vertex%3D%221%22%20parent%3D%221%22%3E%3CmxGeometry%20x%3D%22599.1999999999999%22%20y%3D%221689%22%20width%3D%2220%22%20height%3D%2210%22%20as%3D%22geometry%22%2F%3E%3C%2FmxCell%3E%3CmxCell%20id%3D%22211%22%20style%3D%22edgeStyle%3DorthogonalEdgeStyle%3Brounded%3D0%3BorthogonalLoop%3D1%3BjettySize%3Dauto%3Bhtml%3D1%3BexitX%3D0%3BexitY%3D0.5%3BexitDx%3D0%3BexitDy%3D0%3BendArrow%3Dnone%3BstartFill%3D0%3B%22%20edge%3D%221%22%20parent%3D%221%22%3E%3CmxGeometry%20relative%3D%221%22%20as%3D%22geometry%22%3E%3CmxPoint%20x%3D%22594.8%22%20y%3D%221688.5067289719627%22%20as%3D%22targetPoint%22%2F%3E%3CmxPoint%20x%3D%22634.4%22%20y%3D%221688.46%22%20as%3D%22sourcePoint%22%2F%3E%3C%2FmxGeometry%3E%3C%2FmxCell%3E%3CmxCell%20id%3D%22212%22%20style%3D%22edgeStyle%3DorthogonalEdgeStyle%3Brounded%3D0%3BorthogonalLoop%3D1%3BjettySize%3Dauto%3Bhtml%3D1%3BexitX%3D0%3BexitY%3D0.5%3BexitDx%3D0%3BexitDy%3D0%3BendArrow%3Dnone%3BstartFill%3D0%3B%22%20edge%3D%221%22%20parent%3D%221%22%3E%3CmxGeometry%20relative%3D%221%22%20as%3D%22geometry%22%3E%3CmxPoint%20x%3D%22594.8%22%20y%3D%221678.5067289719627%22%20as%3D%22targetPoint%22%2F%3E%3CmxPoint%20x%3D%22634.4%22%20y%3D%221678.46%22%20as%3D%22sourcePoint%22%2F%3E%3C%2FmxGeometry%3E%3C%2FmxCell%3E%3CmxCell%20id%3D%22213%22%20value%3D%22%26lt%3Bfont%26gt%3BPA5%26lt%3B%2Ffont%26gt%3B%22%20style%3D%22text%3Bhtml%3D1%3Balign%3Dcenter%3BverticalAlign%3Dmiddle%3BwhiteSpace%3Dwrap%3Brounded%3D0%3BfontSize%3D10%3B%22%20vertex%3D%221%22%20parent%3D%221%22%3E%3CmxGeometry%20x%3D%22598.8%22%20y%3D%221679%22%20width%3D%2220%22%20height%3D%2210%22%20as%3D%22geometry%22%2F%3E%3C%2FmxCell%3E%3CmxCell%20id%3D%22214%22%20value%3D%22%26lt%3Bfont%26gt%3BPA4%26lt%3B%2Ffont%26gt%3B%22%20style%3D%22text%3Bhtml%3D1%3Balign%3Dcenter%3BverticalAlign%3Dmiddle%3BwhiteSpace%3Dwrap%3Brounded%3D0%3BfontSize%3D10%3B%22%20vertex%3D%221%22%20parent%3D%221%22%3E%3CmxGeometry%20x%3D%22598.8%22%20y%3D%221669%22%20width%3D%2220%22%20height%3D%2210%22%20as%3D%22geometry%22%2F%3E%3C%2FmxCell%3E%3CmxCell%20id%3D%22215%22%20style%3D%22edgeStyle%3DorthogonalEdgeStyle%3Brounded%3D0%3BorthogonalLoop%3D1%3BjettySize%3Dauto%3Bhtml%3D1%3BexitX%3D0%3BexitY%3D0.5%3BexitDx%3D0%3BexitDy%3D0%3BendArrow%3Dnone%3BstartFill%3D0%3B%22%20edge%3D%221%22%20parent%3D%221%22%3E%3CmxGeometry%20relative%3D%221%22%20as%3D%22geometry%22%3E%3CmxPoint%20x%3D%22594.8%22%20y%3D%221668.5067289719627%22%20as%3D%22targetPoint%22%2F%3E%3CmxPoint%20x%3D%22634.4%22%20y%3D%221668.46%22%20as%3D%22sourcePoint%22%2F%3E%3C%2FmxGeometry%3E%3C%2FmxCell%3E%3CmxCell%20id%3D%22216%22%20value%3D%22%26lt%3Bfont%26gt%3BPA3%26lt%3B%2Ffont%26gt%3B%22%20style%3D%22text%3Bhtml%3D1%3Balign%3Dcenter%3BverticalAlign%3Dmiddle%3BwhiteSpace%3Dwrap%3Brounded%3D0%3BfontSize%3D10%3B%22%20vertex%3D%221%22%20parent%3D%221%22%3E%3CmxGeometry%20x%3D%22598.8%22%20y%3D%221659%22%20width%3D%2220%22%20height%3D%2210%22%20as%3D%22geometry%22%2F%3E%3C%2FmxCell%3E%3CmxCell%20id%3D%22217%22%20style%3D%22edgeStyle%3DorthogonalEdgeStyle%3Brounded%3D0%3BorthogonalLoop%3D1%3BjettySize%3Dauto%3Bhtml%3D1%3BexitX%3D0%3BexitY%3D0.5%3BexitDx%3D0%3BexitDy%3D0%3BendArrow%3Dnone%3BstartFill%3D0%3B%22%20edge%3D%221%22%20parent%3D%221%22%3E%3CmxGeometry%20relative%3D%221%22%20as%3D%22geometry%22%3E%3CmxPoint%20x%3D%22594.8%22%20y%3D%221649.6367289719626%22%20as%3D%22targetPoint%22%2F%3E%3CmxPoint%20x%3D%22634.4%22%20y%3D%221649.59%22%20as%3D%22sourcePoint%22%2F%3E%3C%2FmxGeometry%3E%3C%2FmxCell%3E%3CmxCell%20id%3D%22218%22%20style%3D%22edgeStyle%3DorthogonalEdgeStyle%3Brounded%3D0%3BorthogonalLoop%3D1%3BjettySize%3Dauto%3Bhtml%3D1%3BexitX%3D0%3BexitY%3D0.5%3BexitDx%3D0%3BexitDy%3D0%3BendArrow%3Dnone%3BstartFill%3D0%3B%22%20edge%3D%221%22%20parent%3D%221%22%3E%3CmxGeometry%20relative%3D%221%22%20as%3D%22geometry%22%3E%3CmxPoint%20x%3D%22594.8%22%20y%3D%221639.6367289719626%22%20as%3D%22targetPoint%22%2F%3E%3CmxPoint%20x%3D%22634.4%22%20y%3D%221639.59%22%20as%3D%22sourcePoint%22%2F%3E%3C%2FmxGeometry%3E%3C%2FmxCell%3E%3CmxCell%20id%3D%22219%22%20value%3D%22%26lt%3Bfont%26gt%3BPA1%26lt%3B%2Ffont%26gt%3B%22%20style%3D%22text%3Bhtml%3D1%3Balign%3Dcenter%3BverticalAlign%3Dmiddle%3BwhiteSpace%3Dwrap%3Brounded%3D0%3BfontSize%3D10%3B%22%20vertex%3D%221%22%20parent%3D%221%22%3E%3CmxGeometry%20x%3D%22598.8%22%20y%3D%221640.1299999999999%22%20width%3D%2220%22%20height%3D%2210%22%20as%3D%22geometry%22%2F%3E%3C%2FmxCell%3E%3CmxCell%20id%3D%22220%22%20value%3D%22%26lt%3Bfont%26gt%3BPA0%26lt%3B%2Ffont%26gt%3B%22%20style%3D%22text%3Bhtml%3D1%3Balign%3Dcenter%3BverticalAlign%3Dmiddle%3BwhiteSpace%3Dwrap%3Brounded%3D0%3BfontSize%3D10%3B%22%20vertex%3D%221%22%20parent%3D%221%22%3E%3CmxGeometry%20x%3D%22598.8%22%20y%3D%221630.1299999999999%22%20width%3D%2220%22%20height%3D%2210%22%20as%3D%22geometry%22%2F%3E%3C%2FmxCell%3E%3CmxCell%20id%3D%22221%22%20value%3D%22Out5%22%20style%3D%22text%3Bhtml%3D1%3Balign%3Dcenter%3BverticalAlign%3Dmidd